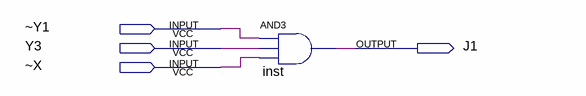
[diagram p0: schematic sheet]
// Quartus schematic J1.bdf as structural Verilog: 1 symbols, 4 pins
module J1 (
  input  \~Y1 ,
  input  Y3,
  input  \~X ,
  output J1
);

  and inst (J1, \~Y1 , Y3, \~X );
endmodule
